# EAGLE schematic Final Project Designs_v1_copy (EAGLE 7.6.0)

## Sheet 1 of 2
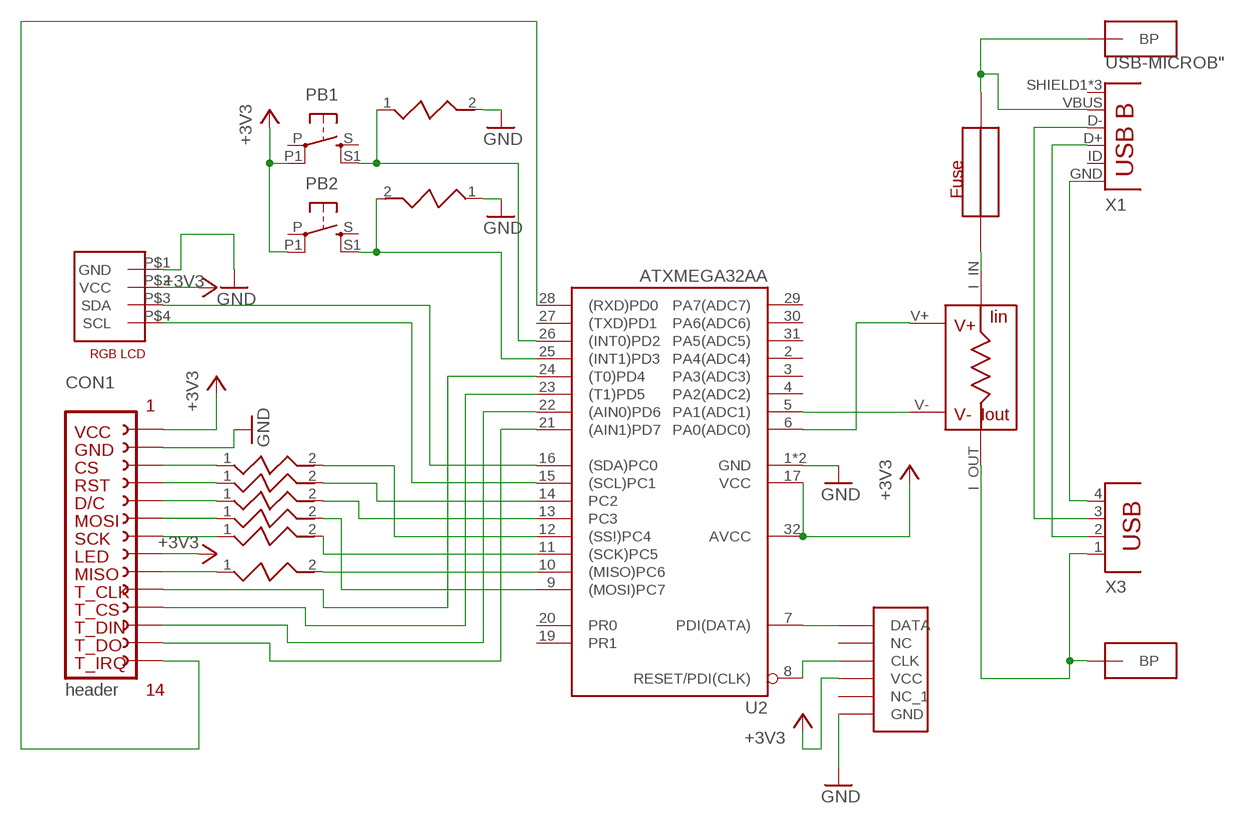
[diagram p0: schematic, sheet 1]

### Parts
CON1  header  14_PIN_FEMALE_HEADER  [FE15]
CON2  4PIN_GROVE_CONNECTORUNIVERSAL_4_PIN_CONNECTOR  [RGB_LCD]
F1  FUSE_SMT  [FUSE_SMT]
PB1  10-XX-4.5SMD  [BT4.5X4.5]
PB2  10-XX-4.5SMD  [BT4.5X4.5]
R1  RESISTOR_4PIN  [RESISTOR_4PIN]
R2  RESISTOR  [RESISTOR]
R3  RESISTOR  [RESISTOR]
R4  RESISTOR  [RESISTOR]
R5  RESISTOR  [RESISTOR]
R6  RESISTOR  [RESISTOR]
R7  RESISTOR  [RESISTOR]
R8  RESISTOR  [RESISTOR]
R9  RESISTOR  [RESISTOR]
U2  ATXMEGA32AA  [TQFP32-08]
X1  USB-MICROB"  [USB-B-MICRO-SMD_V03]
X3  PN87520  [PN87520]
X4  JTAG  [JTAG]
X5  BANANA_PLUG  [BANANA_PLUG]
X6  BANANA_PLUG  [BANANA_PLUG]

### Nets
+3V3: CON1.P$7(LED) CON1.P$14(VCC) CON2.P$2(VCC) PB1.P1 PB2.P1 U2.17(VCC) U2.32(AVCC) X4.VCC
B$2: R1.I_OUT X3.1 X5.P$1(BP) X5.P$2(BP)
GND: CON1.P$13(GND) CON2.P$1(GND) R8.2 R9.1 U2.1(GND) U2.18(GND) X4.GND
N$1: R5.2 U2.9((MOSI)PC7)
N$2: R6.2 U2.11((SCK)PC5)
N$3: CON1.P$9(MOSI) R5.1
N$4: CON2.P$4(SCL) U2.15((SCL)PC1)
N$5: CON2.P$3(SDA) U2.16((SDA)PC0)
N$6: X1.GND X3.4
N$7: X1.D+ X3.2
N$8: X1.D- X3.3
N$9: PB2.S1 R9.2 U2.25((INT1)PD3)
N$10: PB1.S1 R8.1 U2.26((INT0)PD2)
N$11: R2.2 U2.12((SS!)PC4)
N$12: U2.7(PDI(DATA)) X4.DATA
N$13: U2.8(RESET/PDI(CLK)) X4.CLK
N$14: R1.V+ U2.6(PA0(ADC0))
N$15: R1.V- U2.5(PA1(ADC1))
N$16: F1.P$2 R1.I_IN
N$17: CON1.P$10(D/C) R4.1
N$18: CON1.P$11(RESET) R3.1
N$19: CON1.P$6(MISO) R7.1
N$20: R7.2 U2.10((MISO)PC6)
N$21: CON1.P$8(SCK) R6.1
N$22: CON1.P$12(CS) R2.1
N$23: F1.P$1 X1.VBUS X6.P$1(BP) X6.P$2(BP)
N$24: CON1.P$5(T_CLK) U2.24((T0)PD4)
N$25: CON1.P$4(T_CS) U2.23((T1)PD5)
N$26: CON1.P$3(T_DIN) U2.22((AIN0)PD6)
N$27: CON1.P$2(T_DO) U2.21((AIN1)PD7)
N$28: R3.2 U2.14(PC2)
N$29: R4.2 U2.13(PC3)
N$30: CON1.P$1(T_IRQ) U2.28((RXD)PD0)
Unconnected: PB1.P PB1.S PB2.P PB2.S U2.2(PA4(ADC4)) U2.3(PA3(ADC3)) U2.4(PA2(ADC2)) U2.19(PR1) U2.20(PR0) U2.27((TXD)PD1) U2.29(PA7(ADC7)) U2.30(PA6(ADC6)) U2.31(PA5(ADC5)) X1.ID(USBID) X1.SHIELD1(SHIELD) X1.SHIELD2(SHIELD) X1.SHIELD3(SHIELD) X4.NC X4.NC1(NC_1)

## Sheet 2 of 2

## Library data of the parts
CON1 = Tft_lcd_header:14_PIN_FEMALE_HEADER: FEMALE HEADER; OC_FARNELL: unknown; OC_NEWARK: unknown
CON2 = Tft_lcd_header:4PIN_GROVE_CONNECTOR
F1 = fuse_smt:FUSE_SMT
PB1 PB2 = Tft_lcd_header:10-XX: OMRON SWITCH
R1 = Tft_lcd_header:RESISTOR_4PIN
R2-R9 = Tft_lcd_header:RESISTOR
U2 = Tft_lcd_header:ATXMEGA32A: MICROCONTROLLER 2 Kbytes FLASH 128 bytes SRAM 128 bytes EEPROM UART 6-channel 10-bit ADC; OC_FARNELL: unknown; OC_NEWARK: unknown
X1 = SparkFun-Connectors:USB-MICROB; PROD_ID: CONN-11752
X3 = con-berg:PN87520: BERG USB connector; OC_FARNELL: unknown; OC_NEWARK: unknown
X4 = Tft_lcd_header:JTAG
X5 X6 = Tft_lcd_header:BANANA_PLUG